# EAGLE design LiPo-PSU (EAGLE 6.2)

## Sheet 1 of 2
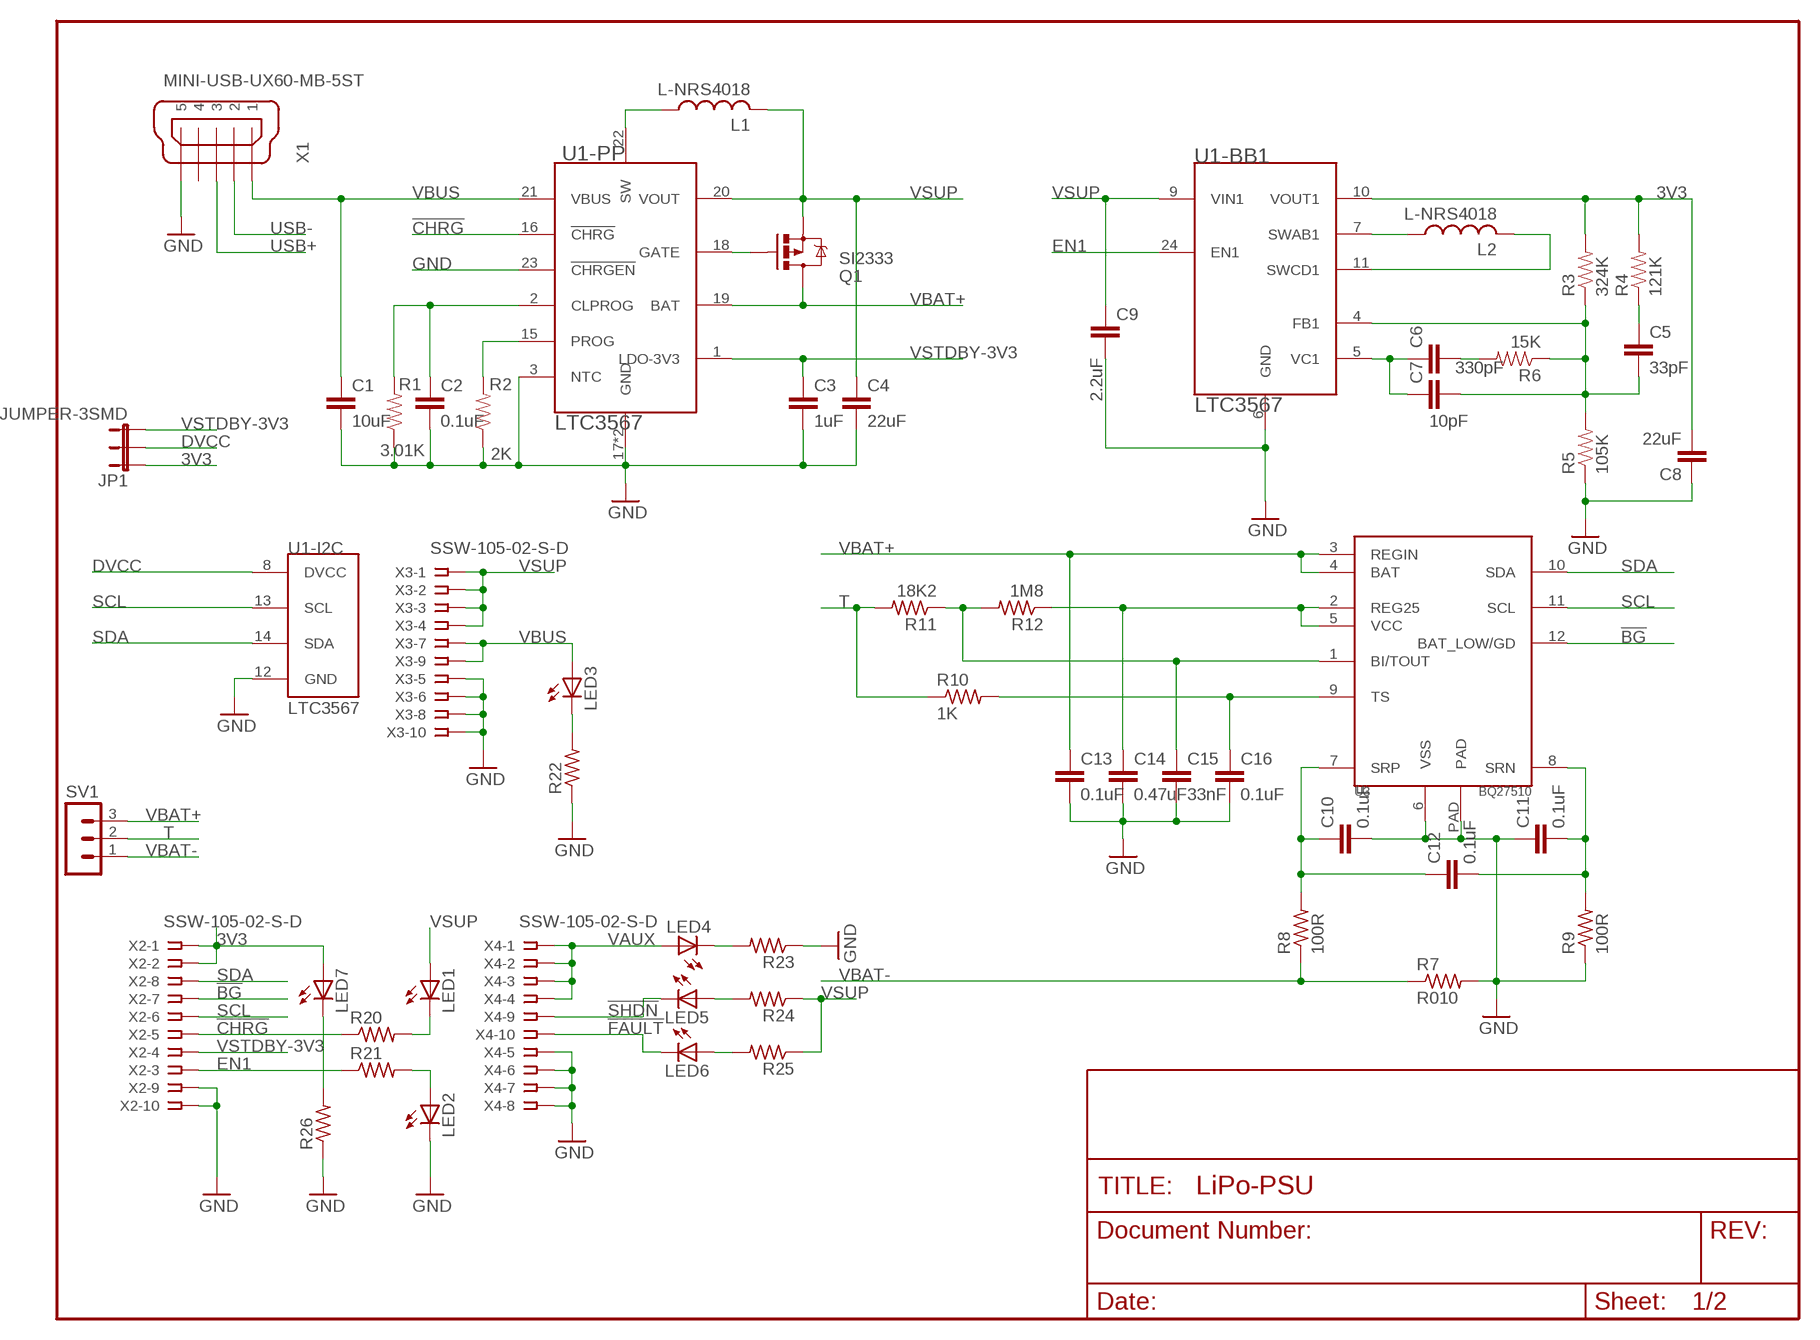
[diagram p0: schematic, sheet 1]

### Parts
C1  10uF  CAP0805  [0805]
C2  0.1uF  CAP0402-CAP  [0402-CAP]
C3  1uF  CAP0402-CAP  [0402-CAP]
C4  22uF  CAP0805  [0805]
C5  33pF  CAP0402-CAP  [0402-CAP]
C6  330pF  CAP0402-CAP  [0402-CAP]
C7  10pF  CAP0402-CAP  [0402-CAP]
C8  22uF  CAP0805  [0805]
C9  2.2uF  CAP0402-CAP  [0402-CAP]
C10  0.1uF  C-EUC0402  [C0402]
C11  0.1uF  C-EUC0402  [C0402]
C12  0.1uF  C-EUC0402  [C0402]
C13  0.1uF  C-EUC0402  [C0402]
C14  0.47uF  C-EUC0402  [C0402]
C15  33nF  C-EUC0402  [C0402]
C16  0.1uF  C-EUC0402  [C0402]
JP1  JUMPER-3SMD  [SJ_3]
L1  L-NRS4018  [NR(S)401X]
L2  L-NRS4018  [NR(S)401X]
LED1  LEDCHIP-LED0603  [CHIP-LED0603]
LED2  LEDCHIP-LED0603  [CHIP-LED0603]
LED3  LEDCHIP-LED0603  [CHIP-LED0603]
LED4  LEDCHIP-LED0603  [CHIP-LED0603]
LED5  LEDCHIP-LED0603  [CHIP-LED0603]
LED6  LEDCHIP-LED0603  [CHIP-LED0603]
LED7  LEDCHIP-LED0603  [CHIP-LED0603]
Q1  SI2333  [SOT23-3]
R1  3.01K  RESISTOR0402-RES  [0402-RES]
R2  2K  RESISTOR0402-RES  [0402-RES]
R3  324K  RESISTOR0402-RES  [0402-RES]
R4  121K  RESISTOR0402-RES  [0402-RES]
R5  105K  RESISTOR0402-RES  [0402-RES]
R6  15K  RESISTOR0402-RES  [0402-RES]
R7  R010  R-US_R2512  [R2512]
R8  100R  R-US_R0402  [R0402]
R9  100R  R-US_R0402  [R0402]
R10  1K  R-US_R0402  [R0402]
R11  18K2  R-US_R0402  [R0402]
R12  1M8  R-US_R0402  [R0402]
R20  R-US_R0402  [R0402]
R21  R-US_R0402  [R0402]
R22  R-US_R0402  [R0402]
R23  R-US_R0402  [R0402]
R24  R-US_R0402  [R0402]
R25  R-US_R0402  [R0402]
R26  R-US_R0402  [R0402]
SV1  MA03-1  [MA03-1]
U1  LTC3567  [QFN24-4X4(UF)]
U3  BQ27510  [DRZ(S-PDSO-N12)]
X1  MINI-USB-UX60-MB-5ST  [UX60-MB-5ST]
X2  SSW-105-02-S-D  [SSW-105-02-S-D]
X3  SSW-105-02-S-D  [SSW-105-02-S-D]
X4  SSW-105-02-S-D  [SSW-105-02-S-D]

### Nets
3V3: C8.2 JP1.1 LED7.A R3.2 R4.2 U1.10(-BB1:VOUT1) X2.1 X2.2 ; also sheet 2
!BG: U3.12(BAT_LOW/GD) X2.7
!CHRG!: R20.1 U1.16(-PP:!CHRG!) X2.5
!FAULT: LED6.C X4.10 ; also sheet 2
!SHDN: LED5.C X4.9 ; also sheet 2
DVCC: JP1.2 U1.8(-I2C:DVCC)
EN1: R21.1 U1.24(-BB1:EN1) X2.3
GND: C1.2 C2.2 C3.2 C4.2 C8.1 C9.2 C10.2 C11.1 C13.2 C14.2 C15.2 C16.2 LED2.C R1.1 R2.1 R5.1 R7.2 R9.1 R22.1 R23.1 R26.1 U1.3(-PP:NTC) U1.6(-BB1:GND) U1.12(-I2C:GND) U1.17(-PP:GND) U1.23(-PP:!CHRGEN!) U1.PAD(-PP:GND) U3.6(VSS) U3.PAD X1.5 X2.9 X2.10 X3.5 X3.6 X3.8 X3.10 X4.5 X4.6 X4.7 X4.8 ; also sheet 2
N$1: L1.1 U1.22(-PP:SW)
N$2: C5.2 C7.2 R3.1 R5.2 R6.1 U1.4(-BB1:FB1)
N$3: Q1.1(G) U1.18(-PP:GATE)
N$4: L2.1 U1.7(-BB1:SWAB1)
N$5: L2.2 U1.11(-BB1:SWCD1)
N$6: C5.1 R4.1
N$7: C15.1 R11.1 R12.2 U3.1(BI/TOUT)
N$8: C6.2 R6.2
N$9: C6.1 C7.1 U1.5(-BB1:VC1)
N$10: C2.1 R1.2 U1.2(-PP:CLPROG)
N$11: R2.2 U1.15(-PP:PROG)
N$15: LED1.C R20.2
N$16: C14.1 R12.1 U3.2(REG25) U3.5(VCC)
N$17: LED2.A R21.2
N$21: LED3.C R22.2
N$25: LED5.A R24.2
N$26: LED6.A R25.2
N$27: LED4.C R23.2
N$28: LED7.C R26.2
SCL: U1.13(-I2C:SCL) U3.11(SCL) X2.6
SDA: U1.14(-I2C:SDA) U3.10(SDA) X2.8
SRN: C11.2 C12.2 R9.2 U3.8(SRN)
SRP: C10.1 C12.1 R8.2 U3.7(SRP)
T: R10.1 R11.2 SV1.2
TIN: C16.1 R10.2 U3.9(TS)
USB+: X1.3 ; also sheet 2
USB-: X1.2 ; also sheet 2
VAUX: LED4.A X4.1 X4.2 X4.3 X4.4 ; also sheet 2
VBAT+: C13.1 Q1.3(D) SV1.3 U1.19(-PP:BAT) U3.3(REGIN) U3.4(BAT)
VBAT-: R7.1 R8.1 SV1.1
VBUS: C1.1 LED3.A U1.21(-PP:VBUS) X1.1 X3.7 X3.9
VSTDBY-3V3: C3.1 JP1.3 U1.1(-PP:LDO-3V3) X2.4
VSUP: C4.1 C9.1 L1.2 LED1.A Q1.2(S) R24.1 R25.1 U1.9(-BB1:VIN1) U1.20(-PP:VOUT) X3.1 X3.2 X3.3 X3.4 ; also sheet 2
Unconnected: X1.4

## Sheet 2 of 2
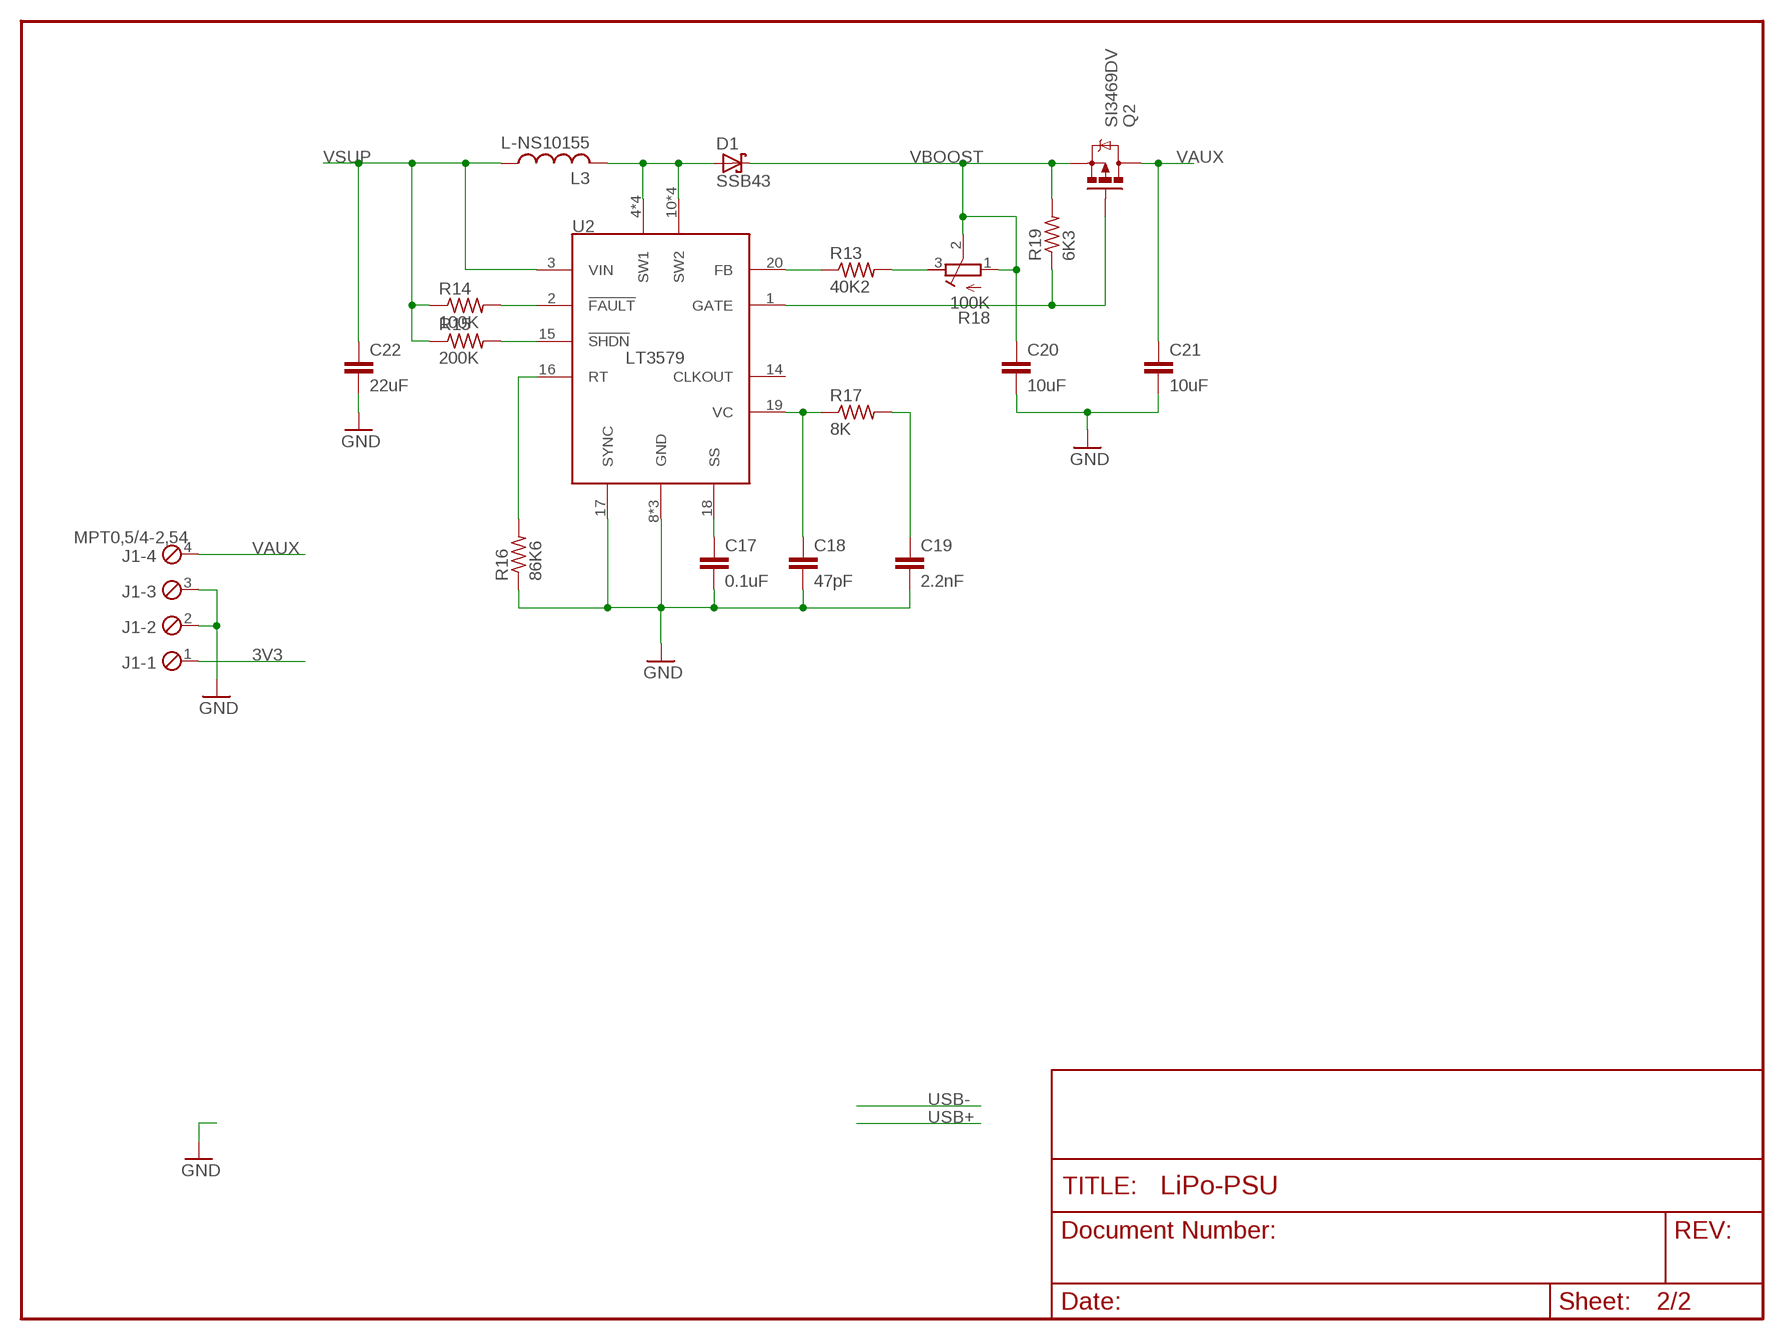
[diagram p1: schematic, sheet 2]

### Parts
C17  0.1uF  C-EUC0402  [C0402]
C18  47pF  C-EUC0402  [C0402]
C19  2.2nF  C-EUC0402  [C0402]
C20  10uF  C-EUC0805  [C0805]
C21  10uF  C-EUC0805  [C0805]
C22  22uF  C-EUC0805  [C0805]
D1  SSB43  MBRS130LT3  [SMB]
J1  MPT0,5/4-2,54  [MPT0,5/4-2,54]
L3  L-NS10155  [NS10155]
Q2  SI3469DV  MOSFET-PCHANNELTSOP6  [TSOP-6]
R13  40K2  R-US_R0402  [R0402]
R14  100K  R-US_R0402  [R0402]
R15  200K  R-US_R0402  [R0402]
R16  86K6  R-US_R0402  [R0402]
R17  8K  R-US_R0402  [R0402]
R18  100K  R-TRIMM3214W  [RTRIM3214W]
R19  6K3  R-US_R0402  [R0402]
U2  LT3579  [QFN20-4X5(UFD)]

### Nets
3V3: J1.1 ; also sheet 1
!FAULT: R14.2 U2.2(!FAULT!) ; also sheet 1
!SHDN: R15.2 U2.15(!SHDN!) ; also sheet 1
BOOST-FB: R13.1 U2.20(FB)
GATE: Q2.3(G) R19.1 U2.1(GATE)
GND: C17.2 C18.2 C19.2 C20.2 C21.2 C22.2 J1.2 J1.3 R16.1 U2.8(GND) U2.9(GND) U2.17(SYNC) U2.PAD(GND) ; also sheet 1
N$12: D1.A L3.2 U2.4(SW1) U2.5(SW1) U2.6(SW1) U2.7(SW1) U2.10(SW2) U2.11(SW2) U2.12(SW2) U2.13(SW2)
N$14: R13.2 R18.3(A)
N$20: R16.2 U2.16(RT)
N$22: C18.1 R17.1 U2.19(VC)
N$23: C19.1 R17.2
N$24: C17.1 U2.18(SS)
VAUX: C21.1 J1.4 Q2.1(D) Q2.2(D) Q2.5(D) Q2.6(D) ; also sheet 1
VBOOST: C20.1 D1.C Q2.4(S) R18.1(E) R18.2(S) R19.2
VSUP: C22.1 L3.1 R14.1 R15.1 U2.3(VIN) ; also sheet 1
Unconnected: U2.14(CLKOUT)

## Library data of the parts
C1-C9 = SparkFun:CAP: Capacitor Standard 0603 ceramic capacitor, and 0.1" leaded capacitor.
C10-C22 = resistor:C-EU: CAPACITOR, European symbol
D1 = diode:MBRS130LT3: Schottky Power Rectifier Source: http://www.onsemi.com/pub/Collateral/MBRS130LT3-D.PDF
J1 = TerminalBlocks-2.54MM:MPT0,5/4-2,54: PC terminal block, Nominal current: 6 A, Nom. voltage: 63 V, Pitch: 2.54 mm, Number of positions: 4, Type of connection: Screw connection, Assembly: Soldering, Conductor/PCB connection direction: 0 °, Color: green
JP1 = SparkFun:JUMPER-3
L1-L3 = LT3579:L
LED1-LED7 = led:LED: LED OSRAM: - CHIPLED LG R971, LG N971, LY N971, LG Q971, LY Q971, LO R971, LY R971 LH N974, LH R974 LS Q976, LO Q976, LY Q976 LO Q996 - Hyper CHIPLED LW Q18S LB Q993, LB Q99A, LB R99A - SideLED LS A670, LO A670, LY A670, LG A670, LP A670 LB A673, LV A673, LT A673, LW A673 LH A674 LY A675 LS A676, LA A676, LO A676, LY A676, LW A676 LS A679, LY A679, LG A679 - Hyper Micro SIDELED® LS Y876, LA Y876, LO Y876, LY Y876 LT Y87S - SmartLED LW L88C, LW L88S LB L89C, LB L89S, LG L890 LS L89K, LO L89K, LY L89K LS L896, LA L896, LO L896, LY L896 - TOPLED LS T670, LO T670, LY T670, LG T670, LP T670 LSG T670, LSP T670, LSY T670, LOP T670, LYG T670 LG T671, LOG T671, LSG T671 LB T673, LV T673, LT T673, LW T673 LH T674 LS T676, LA T676, LO T676, LY T676, LB T676, LH T676, LSB T676, LW T676 LB T67C, LV T67C, LT T67C, LS T67K, LO T67K, LY T67K, LW E67C LS E67B, LA E67B, LO E67B, LY E67B, LB E67C, LV E67C, LT E67C LW T67C LS T679, LY T679, LG T679 LS T770, LO T770, LY T770, LG T770, LP T770 LB T773, LV T773, LT T773, LW T773 LH T774 LS E675, LA E675, LY E675, LS T675 LS T776, LA T776, LO T776, LY T776, LB T776 LHGB T686 LT T68C, LB T68C - Hyper Mini TOPLED® LB M676 - Mini TOPLED Santana® LG M470 LS M47K, LO M47K, LY M47K Source: http://www.osram.convergy.de LUXEON: - LUMILED® LXK2-PW12-R00, LXK2-PW12-S00, LXK2-PW14-U00, LXK2-PW14-V00 LXK2-PM12-R00, LXK2-PM12-S00, LXK2-PM14-U00 LXK2-PE12-Q00, LXK2-PE12-R00, LXK2-PE12-S00, LXK2-PE14-T00, LXK2-PE14-U00 LXK2-PB12-K00, LXK2-PB12-L00, LXK2-PB12-M00, LXK2-PB14-N00, LXK2-PB14-P00, LXK2-PB14-Q00 LXK2-PR12-L00, LXK2-PR12-M00, LXK2-PR14-Q00, LXK2-PR14-R00 LXK2-PD12-Q00, LXK2-PD12-R00, LXK2-PD12-S00 LXK2-PH12-R00, LXK2-PH12-S00 LXK2-PL12-P00, LXK2-PL12-Q00, LXK2-PL12-R00 Source: www.luxeon.com KINGBRIGHT: KA-3528ASYC Source: www.kingbright.com
Q1 = LT3579:SI2333
Q2 = LT3579:MOSFET-PCHANNEL
R1-R6 = SparkFun:RESISTOR: Resistor Basic schematic elements and footprints for 0603, 1206, and PTH resistors.
R7-R17 R19-R26 = resistor:R-US_: RESISTOR, American symbol
R18 = resistor:R-TRIMM: Trimm resistor
SV1 = con-lstb:MA03-1: PIN HEADER; OC_FARNELL: unknown; OC_NEWARK: unknown
U1 = LT3579:LTC3567: LTC3567 High Efficiency USB Power Manager Plus 1A Buck-Boost Converter with I2C Control
U2 = LT3579:LT3579
U3 = LT3579:BQ27510
X1 = con-hirose:MINI-USB-: MINI USB Connector Source: http://www.hirose.co.jp/cataloge_hp/e24000019.pdf; OC_FARNELL: unknown; OC_NEWARK: unknown
X2-X4 = con-samtec:SSW-105-02-S-D: THROUGH-HOLE .025" SQ POST SOCKET Source: Samtec SSW.pdf; MPN: SSW-105-02-S-D; OC_FARNELL: unknown; OC_NEWARK: 11P9398

## Board
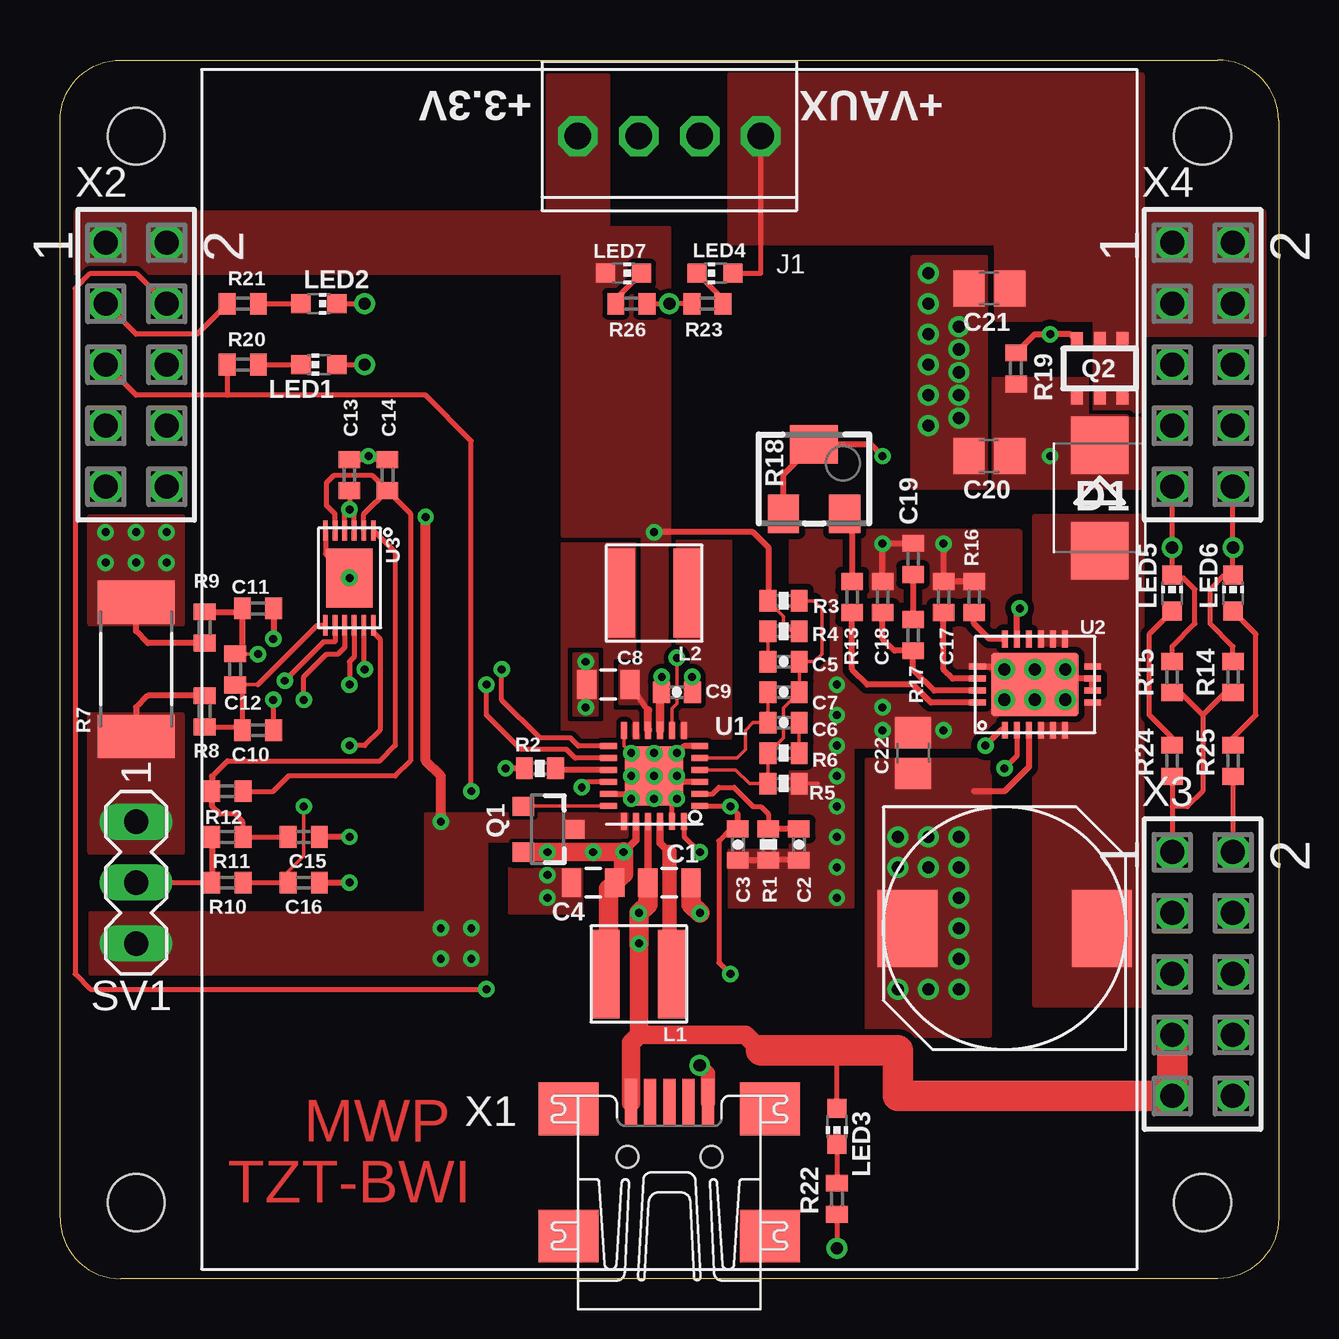
[diagram p2: board, top side]
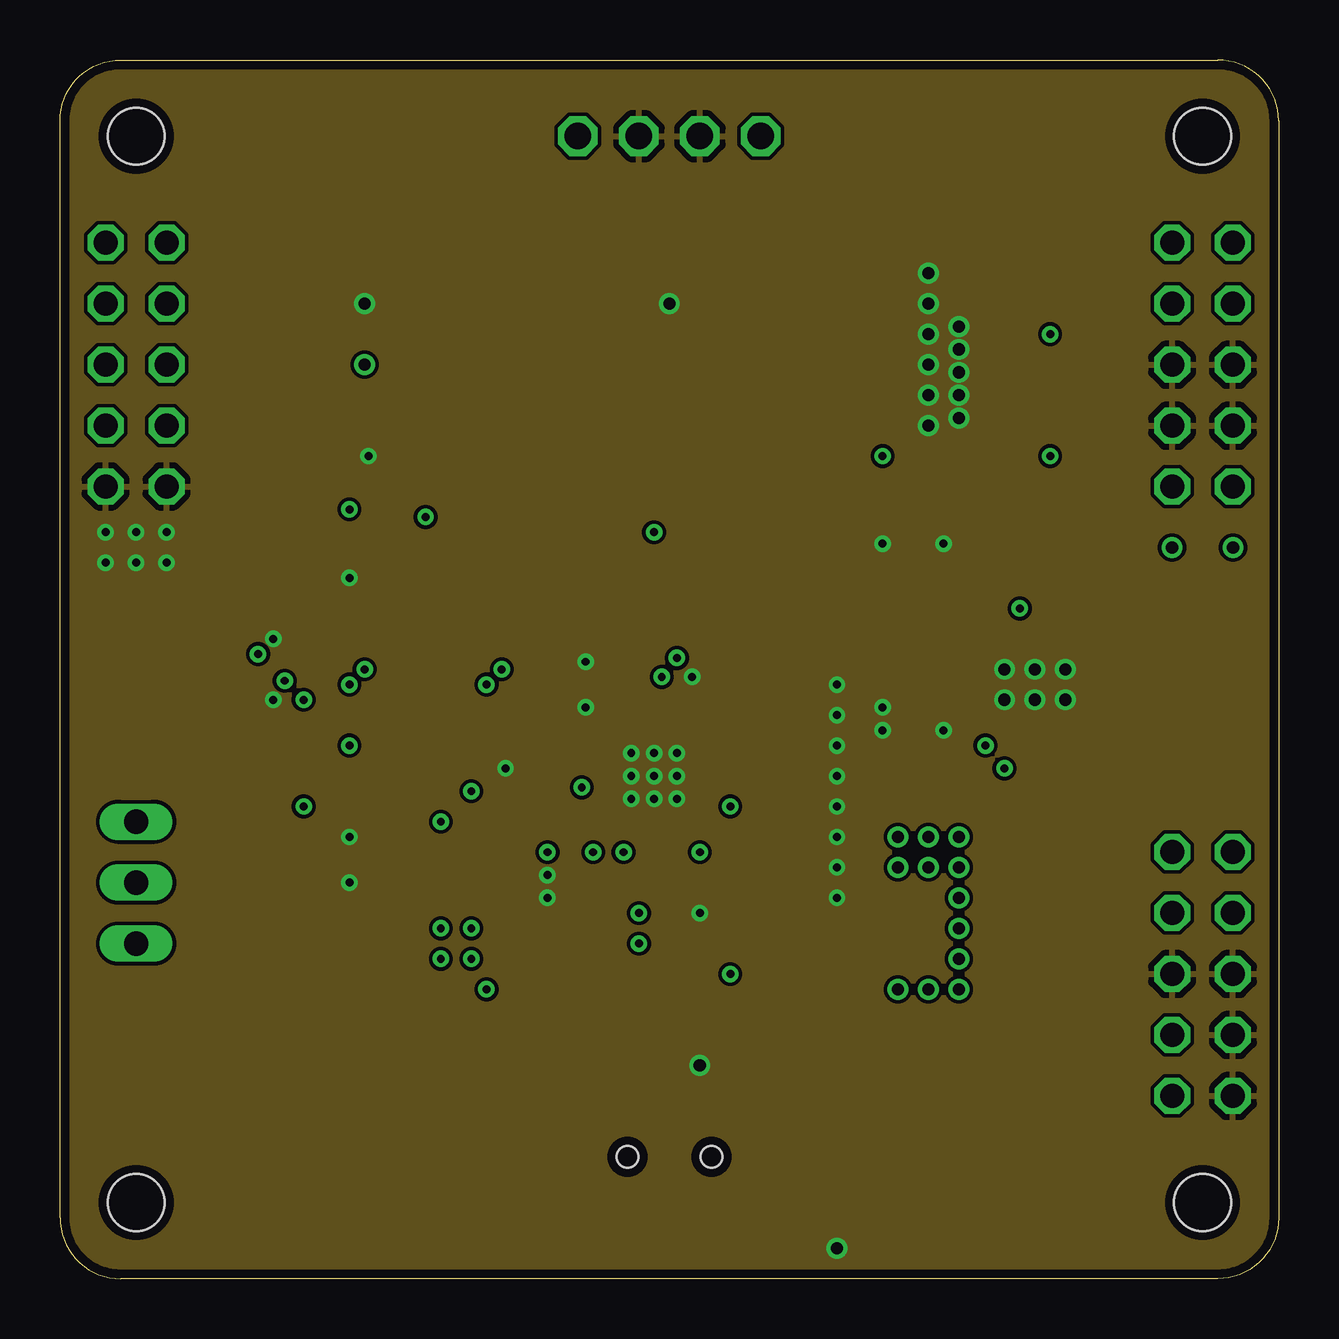
[diagram p3: board, inner layer Route2]
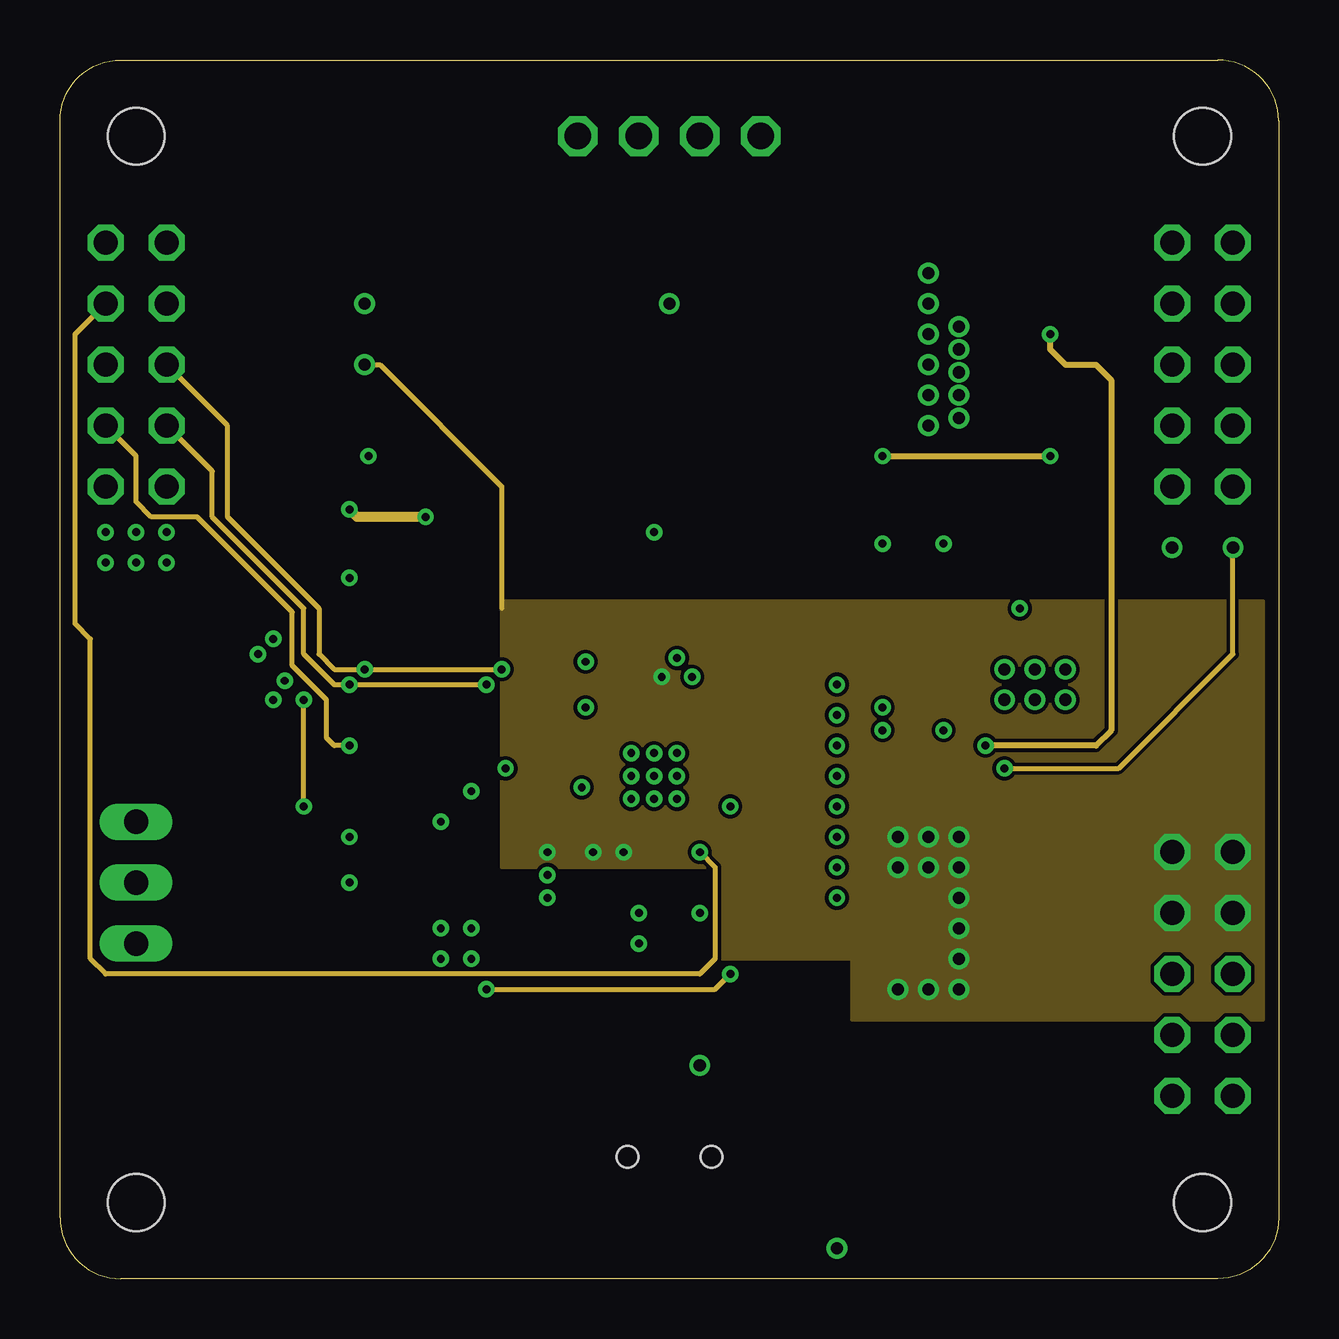
[diagram p4: board, inner layer Route15]
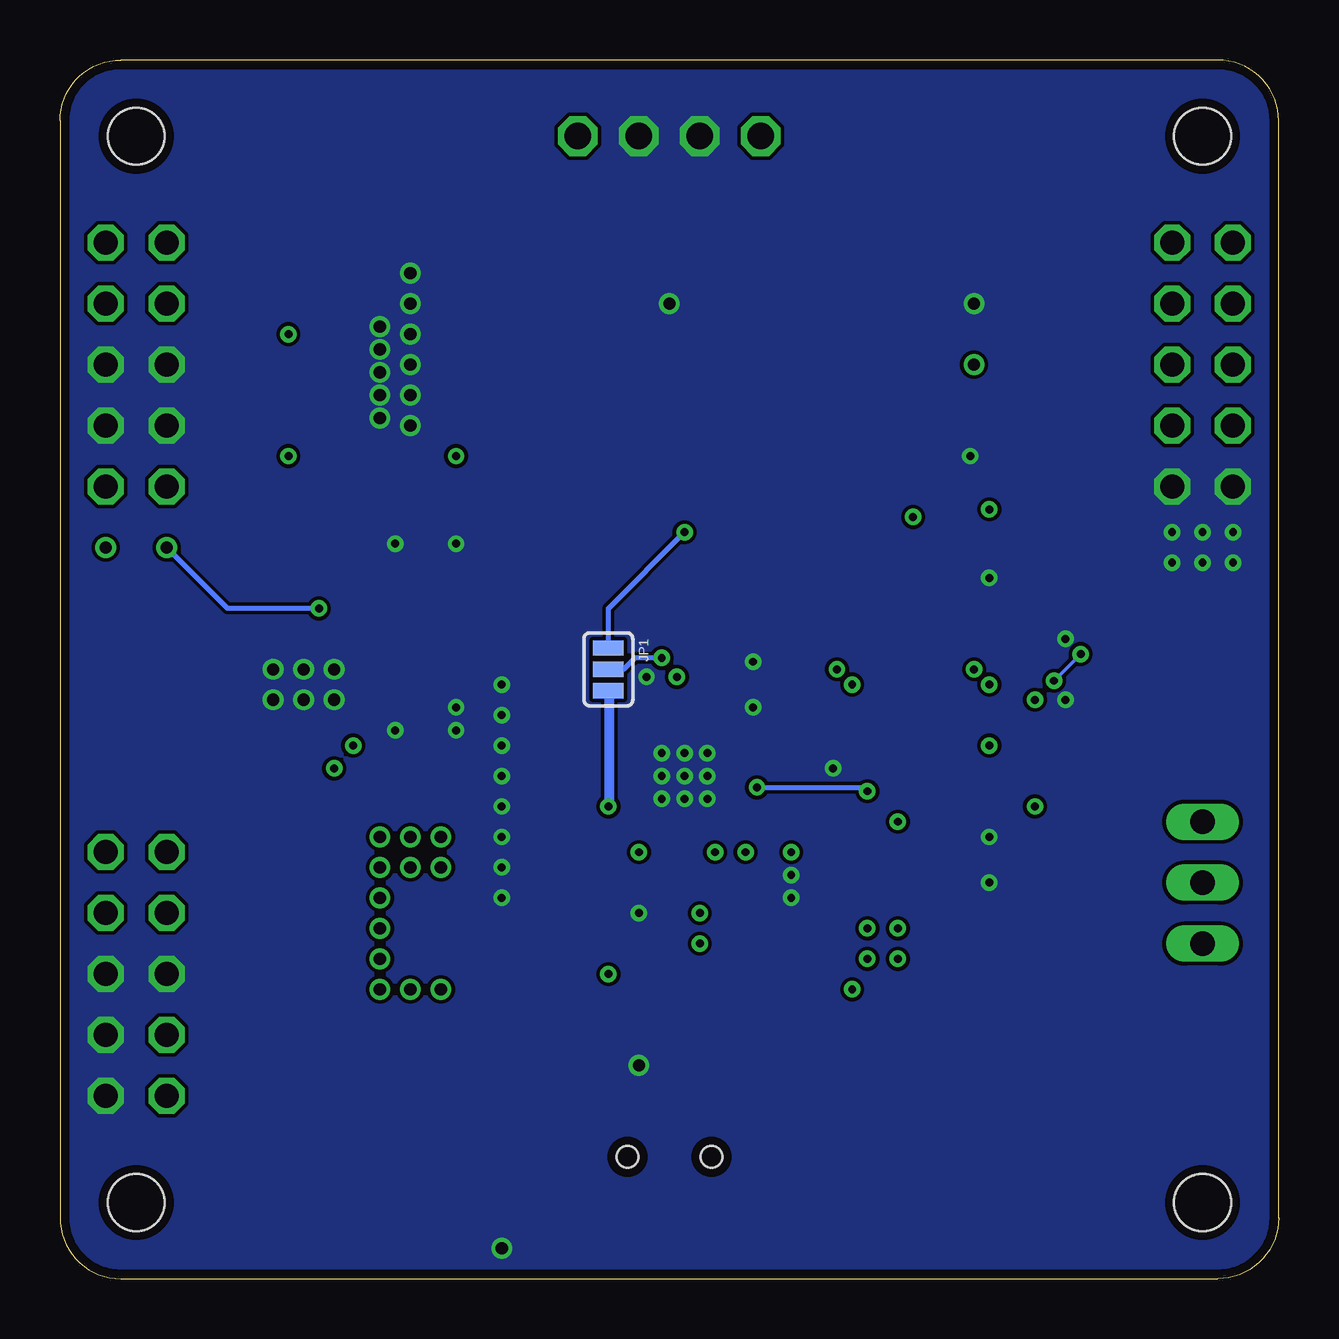
[diagram p5: board, bottom side, seen from below]

Size 50.8 x 50.8 mm. Coordinates in mm from the lower left corner, seen from the top.
Outline: 0,2.54 0,48.26 arc-90 2.54,50.8 48.26,50.8 arc-90 50.8,48.26 50.8,2.54 arc-90 48.26,0 2.54,0 arc-90 0,2.54
Copper layers ((1+2)*(15+16)): Top 0.0356mm / dielectric 0.19811875mm / Route2 0.0356mm / dielectric 39mil / Route15 0.0356mm / dielectric 0.19811875mm / Bottom 0.0356mm
Design rules: minimum track width 6mil, minimum drill 13mil, track to track 6mil, track to pad 6mil, pad to pad 6mil, via to via 6mil, smd to smd 0mil, copper to edge 15mil, drill to drill 6mil, minimum pad ring 7mil, minimum via ring 7mil, stop-mask expansion 4mil, vias tented up to drill 0mil, thermal gap 10mil
Holes 2.36 mm at 3.17,47.62 47.62,47.62 47.62,3.17 3.17,3.17

### Footprints (pad centres in the part's own frame; a part is rotated, then mirrored left to right if it is on the bottom)
0805 = smd 0.8 x 1.2: 1 -0.9,0; 2 0.9,0
0402-CAP = smd 0.7 x 0.9: 1 -0.65,0; 2 0.65,0
C0402 = smd 0.7 x 0.9: 1 -0.65,0; 2 0.65,0
C0805 = smd 1.3 x 1.5: 1 -0.85,0; 2 0.85,0
SMB = smd 2.4 x 2.4: A 2.2,0; C -2.2,0
MPT0,5/4-2,54 = drill 1.1 octagon: 1 -3.81,0; 2 -1.27,0; 3 1.27,0; 4 3.81,0
SJ_3 = smd 0.635 x 1.27: 1 -0.889,0; 2 0,0; 3 0.889,0
NR(S)401X = smd 1.2 x 3.7: 1 -1.4,0; 2 1.4,0
NS10155 = smd 2.5 x 3.2: 1 -4.05,0; 2 4.05,0
CHIP-LED0603 = smd 0.8 x 0.8: A 0,-0.75; C 0,0.75
SOT23-3 = smd 0.8 x 0.9: 1 -0.95,-1; 2 0.95,-1; 3 0,1.1
TSOP-6 = smd 0.5 x 0.7: 1 -0.95,-1.163; 2 0,-1.163; 3 0.95,-1.163; 4 0.95,1.163; 5 0,1.163; 6 -0.95,1.163
0402-RES = smd 0.7 x 0.9: 1 -0.65,0; 2 0.65,0
R2512 = smd 1.8 x 3.2: 1 -2.8,0; 2 2.8,0
R0402 = smd 0.7 x 0.9: 1 -0.65,0; 2 0.65,0
RTRIM3214W = smd 1.3 x 1.6: 1 -1.275,-1.45; 3 1.275,-1.45 | smd 2 x 1.6: 2 0,1.45
MA03-1 = drill 1.016 long: 1 -2.54,0; 2 0,0; 3 2.54,0
QFN24-4X4(UF) = smd 0.25 x 0.7: 1 -1.25,-1.9; 2 -0.75,-1.9; 3 -0.25,-1.9; 4 0.25,-1.9; 5 0.75,-1.9; 6 1.25,-1.9; 13 1.25,1.9; 14 0.75,1.9; 15 0.25,1.9; 16 -0.25,1.9; 17 -0.75,1.9; 18 -1.25,1.9 | smd 0.7 x 0.25: 7 1.9,-1.25; 8 1.9,-0.75; 9 1.9,-0.25; 10 1.9,0.25; 11 1.9,0.75; 12 1.9,1.25; 19 -1.9,1.25; 20 -1.9,0.75; 21 -1.9,0.25; 22 -1.9,-0.25; 23 -1.9,-0.75; 24 -1.9,-1.25 | smd 2.45 x 2.45: PAD 0,0
QFN20-4X5(UFD) = smd 0.25 x 0.7: 1 -1.25,-1.9; 2 -0.75,-1.9; 3 -0.25,-1.9; 4 0.25,-1.9; 5 0.75,-1.9; 6 1.25,-1.9; 11 1.25,1.9; 12 0.75,1.9; 13 0.25,1.9; 14 -0.25,1.9; 15 -0.75,1.9; 16 -1.25,1.9 | smd 0.7 x 0.25: 7 2.4,-0.75; 8 2.4,-0.25; 9 2.4,0.25; 10 2.4,0.75; 17 -2.4,0.75; 18 -2.4,0.25; 19 -2.4,-0.25; 20 -2.4,-0.75 | smd 3.65 x 2.65: PAD 0,0
DRZ(S-PDSO-N12) = smd 0.2 x 0.85: 1 -1,-1.975; 2 -0.6,-1.975; 3 -0.2,-1.975; 4 0.2,-1.975; 5 0.6,-1.975; 6 1,-1.975; 7 1,1.975; 8 0.6,1.975; 9 0.2,1.975; 10 -0.2,1.975; 11 -0.6,1.975; 12 -1,1.975 | smd 1.95 x 2.45: PAD 0,0
UX60-MB-5ST = smd 2 x 0.5: 1 2.25,1.6; 2 2.25,0.8; 3 2.25,0; 4 2.25,-0.8; 5 2.25,-1.6 | smd 2.2 x 2.5: M1 -3.3,-4.2; M2 -3.3,4.2; M3 2,4.2; M4 2,-4.2 | hole 0.9: 0,-1.75; 0,1.75
SSW-105-02-S-D = drill 1 pad 1.5 octagon: 1 -5.08,-1.27; 2 -5.08,1.27; 3 -2.54,-1.27; 4 -2.54,1.27; 5 0,-1.27; 6 0,1.27; 7 2.54,-1.27; 8 2.54,1.27; 9 5.08,-1.27; 10 5.08,1.27

### Placement (x,y rotation side)
C1  25.4,16.51 0 top
C2  30.8,18.1 270 top
C3  28.26,18.1 270 top
C4  22.23,16.51 180 top
C5  30.16,25.72 0 top
C6  30.16,23.18 0 top
C7  30.16,24.45 0 top
C8  22.86,24.77 0 top
C9  25.72,24.45 0 top
C10  8.26,22.86 0 top
C11  8.26,27.94 180 top
C12  7.3,25.4 90 top
C13  12.06,33.5 90 top
C14  13.65,33.5 90 top
C15  10.16,18.41 0 top
C16  10.16,16.51 0 top
C17  36.83,28.42 90 top
C18  34.29,28.42 90 top
C19  35.56,30 90 top
C20  38.73,34.29 180 top
C21  38.73,41.27 180 top
C22  35.56,21.91 90 top
D1  43.34,32.54 270 top
J1  25.4,47.62 0 top
JP1  27.94,25.4 270 bottom
L1  24.13,12.7 180 top
L2  24.77,28.57 180 top
L3  39.37,14.61 0 top
LED1  10.79,38.1 90 top
LED2  10.79,40.64 270 top
LED3  32.38,6.35 180 top
LED4  27.3,41.91 90 top
LED5  46.35,28.57 0 top
LED6  48.9,28.57 0 top
LED7  23.5,41.91 270 top
Q1  20.32,18.73 270 top
Q2  43.34,37.94 180 top
R1  29.53,18.1 90 top
R2  20,21.27 0 top
R3  30.16,28.26 180 top
R4  30.16,26.99 0 top
R5  30.16,20.64 180 top
R6  30.16,21.91 0 top
R7  3.17,25.4 90 top
R8  6.03,23.65 270 top
R9  6.03,27.15 90 top
R10  6.99,16.51 0 top
R11  6.99,18.41 180 top
R12  6.99,20.32 180 top
R13  33.02,28.42 90 top
R14  48.9,25.08 90 top
R15  46.35,25.08 90 top
R16  38.1,28.42 270 top
R17  35.56,26.83 90 top
R18  31.43,33.34 0 top
R19  39.85,37.94 270 top
R20  7.62,38.1 0 top
R21  7.62,40.64 0 top
R22  32.38,3.33 90 top
R23  26.99,40.64 0 top
R24  46.35,21.59 90 top
R25  48.9,21.59 90 top
R26  23.81,40.64 180 top
SV1  3.17,16.51 270 top
U1  24.77,20.95 90 top
U2  40.64,24.77 0 top
U3  12.06,29.21 180 top
U$1  [LP503950]  25.4,25.4 0 top
X1  25.4,5.08 90 top
X2  3.17,38.1 270 top
X3  47.62,12.7 270 top
X4  47.62,38.1 270 top

### Tracks (layer width: path | path; a pad name or v marks a point on that pad's centre or on a via)
3V3  (via drill 0.33)
  Top 0.152: R4.2 30.48,26.99 30.16,27.3 30.16,27.61 R3.2
  Top 0.254: 24.52,23.69 C8.2 | v24.77,31.11 28.89,31.11 29.53,30.48 29.53,28.27 R3.2
  Top 0.33: U1.10 24.52,23.69
  Bottom 0.203: JP1.1 27.94,27.94 v24.77,31.11
  pour Top (isolate 0.203, no thermals): 24.77,23.97 23.34,23.97 23.34,25.56 24.29,25.56 24.29,30.96 20.95,30.96 20.95,41.91 0.64,41.91 0.64,44.45 20.32,44.45 20.32,50.16 22.86,50.16 22.86,43.81 25.4,43.81 25.4,25.56 24.77,25.56
!BG  (via drill 0.33)
  Top 0.203: U3.12 13.06,26.94 13.34,26.67 13.34,22.86 12.7,22.23 v12.06,22.23
  Route15 0.203: v12.06,22.23 11.43,22.23 11.11,22.54 11.11,24.13 9.68,25.56 9.68,27.78 5.71,31.75 3.81,31.75 3.17,32.38 3.17,34.29 X2.7
!CHRG!  (via drill 0.33)
  Top 0.203: U1.16 21.98,20.7 v21.75,20.48 | v17.14,20.32 17.14,34.92 15.24,36.83 6.99,36.83 | 6.99,36.83 3.17,36.83 X2.5 | R20.1 6.97,36.84 6.99,36.83
  Bottom 0.203: v21.75,20.48 17.3,20.48 v17.14,20.32
!FAULT  (via drill 0.33, 0.51)
  Top 0.203: U2.2 39.89,21.79 v39.37,21.27 | X4.10 v48.9,30.48 LED6.C 48.53,29.32 47.94,28.73 47.94,27.3 48.9,26.35 R14.2
  Route15 0.203: v39.37,21.27 44.13,21.27 48.9,26.04 v48.9,30.48
!SHDN  (via drill 0.33, 0.51)
  Top 0.203: X4.9 v46.35,30.48 LED5.C 46.47,29.21 46.83,29.21 47.31,28.73 47.31,27.3 46.35,26.35 R15.2
  Top 0.254: U2.15 39.89,27.82 v40.01,27.94
  Bottom 0.203: v40.01,27.94 43.81,27.94 v46.35,30.48
BOOST-FB
  Top 0.254: U2.20 36.31,24.02 35.56,24.77 33.66,24.77 33.02,25.4 R13.1
DVCC  (via drill 0.33)
  Top 0.152: U1.8 25.52,23.77 25.72,23.97 v25.72,25.88
  Bottom 0.203: v25.72,25.88 26.83,25.88 27.3,25.4 JP1.2
EN1  (via drill 0.33)
  Top 0.203: U1.24 26.02,18.43 v26.67,17.78 | R21.1 6.97,40.62 5.71,39.37 3.17,39.37 X2.3
  Route15 0.203: v26.67,17.78 27.3,17.14 27.3,13.34 26.67,12.7 1.91,12.7 1.27,13.34 1.27,26.67 0.64,27.3 0.64,39.37 X2.3
GATE  (via drill 0.33)
  Top 0.254: U2.1 39.22,22.86 v38.58,22.23 | Q2.3 42.12,39.37 v41.27,39.37 40.62,39.37 R19.1
  Route15 0.254: v38.58,22.23 43.18,22.23 43.81,22.86 43.81,37.47 43.18,38.1 41.91,38.1 41.27,38.73 v41.27,39.37
GND  (via drill 0.33, 0.51)
  Top 0.152: 31.59,20.64 R5.1 | U1.12 23.52,22.2 v23.81,21.91
  Top 0.203: C10.2 8.9,24.11 | U1.23 25.52,19.8 v25.72,20 | U3.6 11.06,30.21 U3.PAD | C13.2 12.71,34.15 v12.86,34.29 13,34.15 C14.2 | R26.1 v25.4,40.64 R23.1 | LED2.C v12.7,40.64 | R22.1 v32.38,1.27 | U2.PAD v40.64,25.4
  Top 0.254: v26.35,25.08 26.35,24.46 C9.2 | U1.6 26.02,22.2 v25.72,21.91 | U1.17 23.61,20.2 v23.81,20 | U1.3 25.97,20.7 v25.72,20.95 | C3.2 R1.1 C2.2 | R9.1 3.67,26.5 3.17,26.99 R7.2 | R2.1 v18.57,21.27 | 8.9,24.11 v8.89,24.13 | C11.1 8.9,26.68 v8.89,26.67 | U2.8 U2.9 41.91,25.02 v41.91,25.4 | U2.17 39.37,25.52 v39.37,25.4 | R16.1 C17.2 v36.83,30.64 | C18.2 v34.29,30.64 34.3,30.65 C19.2 | v12.06,18.41 C15.2 | C16.2 v12.06,16.51
  Top 0.61: X1.5 27,8.56 v26.67,8.89
  Top 0.813: C1.2 26.3,15.61 v26.67,15.24
  other vias: 23.81,20.95 24.77,21.91 24.77,20 24.77,20.95 21.91,23.81 21.91,25.72 20.32,15.88 20.32,16.83 1.91,29.84 3.17,29.84 4.45,29.84 1.91,31.11 3.17,31.11 4.45,31.11 39.37,24.13 40.64,24.13 34.29,22.86 36.83,22.86 34.29,23.81 32.38,24.77 32.38,15.88 37.47,39.69 37.47,38.73 37.47,37.78 37.47,36.83 37.47,35.88 41.91,24.13 32.38,23.5 32.38,19.68 32.38,22.23 32.38,20.95 32.38,18.41 32.38,17.14 12.06,29.21 36.2,41.91 36.2,40.64 36.2,39.37 36.2,38.1 36.2,36.83 36.2,35.56
  pour Route2: 0,0 0,50.8 50.8,50.8 50.8,0
  pour Top (isolate 0.254, no thermals): 21.75,17.3 21.75,15.24 18.73,15.24 18.73,17.3
  pour Top (no thermals): 21.43,23.5 22.38,23.5 22.38,26.04 21.43,26.04
  pour Top (no thermals): 1.27,27.3 1.27,31.75 5.08,31.75 5.08,27.3
  pour Top (isolate 0.254, rank 2, no thermals): 30.48,31.11 30.48,17.78 27.62,17.78 27.62,15.56 33.02,15.56 33.02,22.23 40.01,22.23 40.01,31.11
  pour Top (isolate 0.254, no thermals): 35.56,42.55 35.56,33.02 38.58,33.02 38.58,42.55
  pour Bottom (rank 2, no thermals): 0,50.8 50.8,50.8 50.8,0 0,0
N$1
  Top 0.305: U1.22 25.02,18.16 25.4,17.78
  Top 0.61: 25.4,17.78 25.4,12.57 L1.1
N$2
  Top 0.152: R3.1 31.43,28.26 31.75,27.94 31.75,26.04 31.43,25.72 C5.2 C7.2 30.16,23.8 30.16,22.54 29.53,21.91 R6.1 R5.2 28.73,20.64 28.17,21.2 U1.4
N$3
  Top 0.152: U1.18 19.34,19.7 Q1.1
N$4
  pour Top (isolate 0.203, rank 2, no thermals): 25.56,22.54 27.94,22.54 27.94,30.8 25.56,30.8
N$5
  pour Top (isolate 0.203, rank 2, no thermals): 24.13,22.54 20.95,22.54 20.95,30.8 24.13,30.8
N$6
  Top 0.152: C5.1 R4.1
N$7
  Top 0.203: 6.35,19.68 6.67,19.37 7.3,19.37 7.63,19.04 R11.1 C15.1 | 6.33,20.94 6.99,21.59 13.34,21.59 13.97,22.23 13.97,30.28 U3.1
  Top 0.254: 6.35,19.68 6.35,20.3 R12.2 6.33,20.94
N$8
  Top 0.152: R6.2 30.81,22.23 30.8,22.23 30.8,23.18 C6.2
N$9
  Top 0.152: C7.1 C6.1 28.89,23.18 28.57,22.86 28.57,22.07 28.21,21.7 U1.5
N$10
  Top 0.203: U1.2 27.19,20.2 27.46,20.48 28.1,20.48 28.89,19.68 29.21,19.68 29.53,19.37 R1.2
  Top 0.254: C2.1 R1.2
N$11
  Top 0.254: U1.15 20.72,21.2 R2.2
N$12
  pour Top (isolate 0.254, no thermals): 40.64,31.75 40.64,11.43 45.09,11.43 45.09,31.75
N$14
  Top 0.254: R18.3 33.02,31.57 R13.2
N$15
  Top 0.203: R20.2 LED1.C
N$16
  Top 0.203: R12.1 8.89,20.32 9.53,20.95 13.97,20.95 14.61,21.59 14.61,31.89 C14.1 | U3.2 12.66,31.87 13.18,32.38 13.19,32.38 C14.1 | U3.5 11.46,31.87 11.11,32.23 11.11,33.18 11.43,33.5 13,33.5 C14.1
N$17
  Top 0.203: R21.2 LED2.A
N$20
  Top 0.254: U2.16 38.74,26.66 38.1,27.3 R16.2
N$21
  Top 0.203: LED3.C R22.2
N$22
  Top 0.254: U2.19 36.45,24.52 35.56,25.4 R17.1 34.78,26.18 34.29,26.67 C18.1
N$23
  Top 0.254: C19.1 R17.2
N$24
  Top 0.254: U2.18 37.22,25.02 36.83,25.4 C17.1
N$25
  Top 0.203: R24.2 46.35,22.54 45.4,23.5 45.4,26.87 LED5.A
N$26
  Top 0.203: R25.2 48.9,22.54 49.85,23.5 49.85,26.87 LED6.A
N$27
  Top 0.203: R23.2 27.64,40.83 LED4.C
N$28
  Top 0.203: R26.2 23.16,40.83 LED7.C
SCL  (via drill 0.33)
  Top 0.203: U1.13 21.61,22.2 21.27,22.54 20,22.54 18.41,24.13 v18.41,25.4 | U3.11 12.66,25.43 v12.7,25.4
  Route15 0.203: X2.6 6.99,35.56 6.99,31.75 10.79,27.94 10.79,26.04 11.43,25.4 v12.7,25.4 v18.41,25.4
SDA  (via drill 0.33)
  Top 0.203: U1.14 21.48,21.7 21.11,22.07 19.21,22.07 17.78,23.5 v17.78,24.77 | U3.10 12.27,25.92 12.06,25.72 v12.06,24.77
  Route15 0.203: X2.8 6.35,33.66 6.35,31.75 10.16,27.94 10.16,26.04 11.43,24.77 v12.06,24.77 v17.78,24.77
SRN  (via drill 0.33)
  Top 0.152: v8.26,26.04 7.32,26.04 C12.2
  Top 0.203: U3.8 11.46,26.55 10.99,26.55 v9.37,24.92
  Top 0.254: R9.2 7.46,27.8 C11.2 7.61,26.35 C12.2
  Bottom 0.152: v9.37,24.92 v8.26,26.04
SRP
  Top 0.152: 8.26,24.77 7.32,24.77 C12.1
  Top 0.203: R8.2 7.46,23 | C10.1 7.61,24.45 | U3.7 10.72,27.23 8.26,24.77
  Top 0.254: 7.46,23 C10.1 | 7.61,24.45 C12.1
T
  Top 0.203: SV1.2 R10.1
  Top 0.254: R11.2 R10.1
TIN  (via drill 0.33)
  Top 0.152: C16.1 9.51,16.97 10.16,17.62 v10.16,19.68
  Top 0.203: R10.2 C16.1 | U3.9 11.87,26.31 11.59,26.04 11.11,26.04 10.16,25.08 v10.16,24.13
  Route15 0.203: v10.16,19.68 v10.16,24.13
VAUX
  Top 0.203: LED4.A 29.21,41.91 J1.4
  pour Top (isolate 0.254, rank 2, no thermals): 43.18,36.2 43.18,40.01 39.05,40.01 39.05,43.18 27.94,43.18 27.94,50.16 45.09,50.16 45.09,44.45 50.16,44.45 50.16,39.37 45.09,39.37 45.09,36.2
VBAT+  (via drill 0.33)
  Top 0.203: U3.4 11.87,31.87 v12.06,32.07 | U3.3 12.27,31.87 v12.06,32.07 | C13.1 v12.06,32.07
  Top 0.406: v15.88,19.05 15.88,20.95 15.24,21.59 v15.24,31.75
  Route15 0.406: v15.24,31.75 12.38,31.75 v12.06,32.07
  other vias: 17.14,13.34 17.14,14.61 15.88,13.34 15.88,14.61
  pour Top (no thermals): 23.65,19.37 23.65,18.26 17.78,18.26 17.78,12.7 1.27,12.7 1.27,15.24 15.24,15.24 15.24,19.37
VBAT-
  Top 0.254: R8.1 3.67,24.3 3.17,23.81 R7.1
  pour Top (no thermals): 1.27,17.78 1.27,23.5 5.08,23.5 5.08,17.78
VBOOST  (via drill 0.33)
  Top 0.254: v34.29,34.29 33.79,34.79 R18.2 30.16,33.51 R18.1
  Route15 0.254: v34.29,34.29 v41.27,34.29
  pour Top (rank 3, no thermals): 38.89,37.47 38.89,33.02 45.09,33.02 45.09,37.47
VBUS  (via drill 0.33)
  Top 0.203: LED3.A 32.38,9.53
  Top 0.305: U1.21 24.52,16.52 C1.1
  Top 0.762: X1.1 23.8,9.83 24.13,10.16 | 24.13,10.16 v24.13,13.97 | 29.21,9.53 28.57,10.16 24.13,10.16
  Top 0.813: v24.13,13.97 v24.13,15.24 24.5,15.61 C1.1
  Top 1.27: X3.7 X3.9 34.92,7.62 34.92,9.53 32.38,9.53 29.21,9.53
VSTDBY-3V3  (via drill 0.33)
  Top 0.203: C3.1 27.95,18.75 27.46,18.26 27.46,13.18 v27.94,12.7 | U1.1 27.92,19.7 v27.94,19.68 28.26,19.37 | v17.78,12.06 1.27,12.06 0.64,12.7 0.64,41.27 1.27,41.91 3.17,41.91 X2.4
  Top 0.254: C3.1 28.26,19.37
  Route15 0.203: v17.78,12.06 27.3,12.06 v27.94,12.7
  Bottom 0.406: JP1.3 27.92,24.49 27.92,19.7 v27.94,19.68
VSUP  (via drill 0.33, 0.51)
  Top 0.203: LED1.A v12.7,38.1 | R25.1 X3.2 | R24.1 46.35,19.68 | 46.35,19.68 X3.1 | R15.1 46.69,24.43 47.62,23.5 | 47.62,23.5 47.62,20.32 46.99,19.68 46.35,19.68 | R14.1 48.56,24.43 47.62,23.5
  Top 0.254: 25.02,24.39 C9.1 25.08,24.46 v25.08,25.08 | U2.3 40.39,21.34 39.37,20.32 38.1,20.32
  Top 0.305: U1.20 24.02,18.3 v23.5,17.78 | Q1.2
  Top 0.356: U1.9 25.02,24.39
  Top 0.762: v23.5,17.78 Q1.2
  Top 0.813: v23.5,17.78 23.5,16.88 C4.1 22.86,16.25 22.86,12.83 L1.2
  Route15 0.203: v12.7,38.1 13.34,38.1 18.41,33.02 18.41,27.94
  other vias: 36.2,18.41 36.2,17.14 34.92,17.14 34.92,18.41 36.2,12.06 34.92,12.06 37.47,18.41 37.47,17.14 37.47,12.06 37.47,13.34 37.47,14.61 37.47,15.88 22.23,17.78 20.32,17.78
  pour Route15 (no thermals): 18.41,17.14 27.3,17.14 27.3,13.34 33.02,13.34 33.02,10.79 50.16,10.79 50.16,28.26 18.41,28.26
  pour Top (isolate 0.254, rank 3, no thermals): 33.66,21.59 33.66,10.16 38.73,10.16 38.73,21.59

### Text on the board
Top: MWP | TZT-BWI
tNames: +3.3V | +VAUX